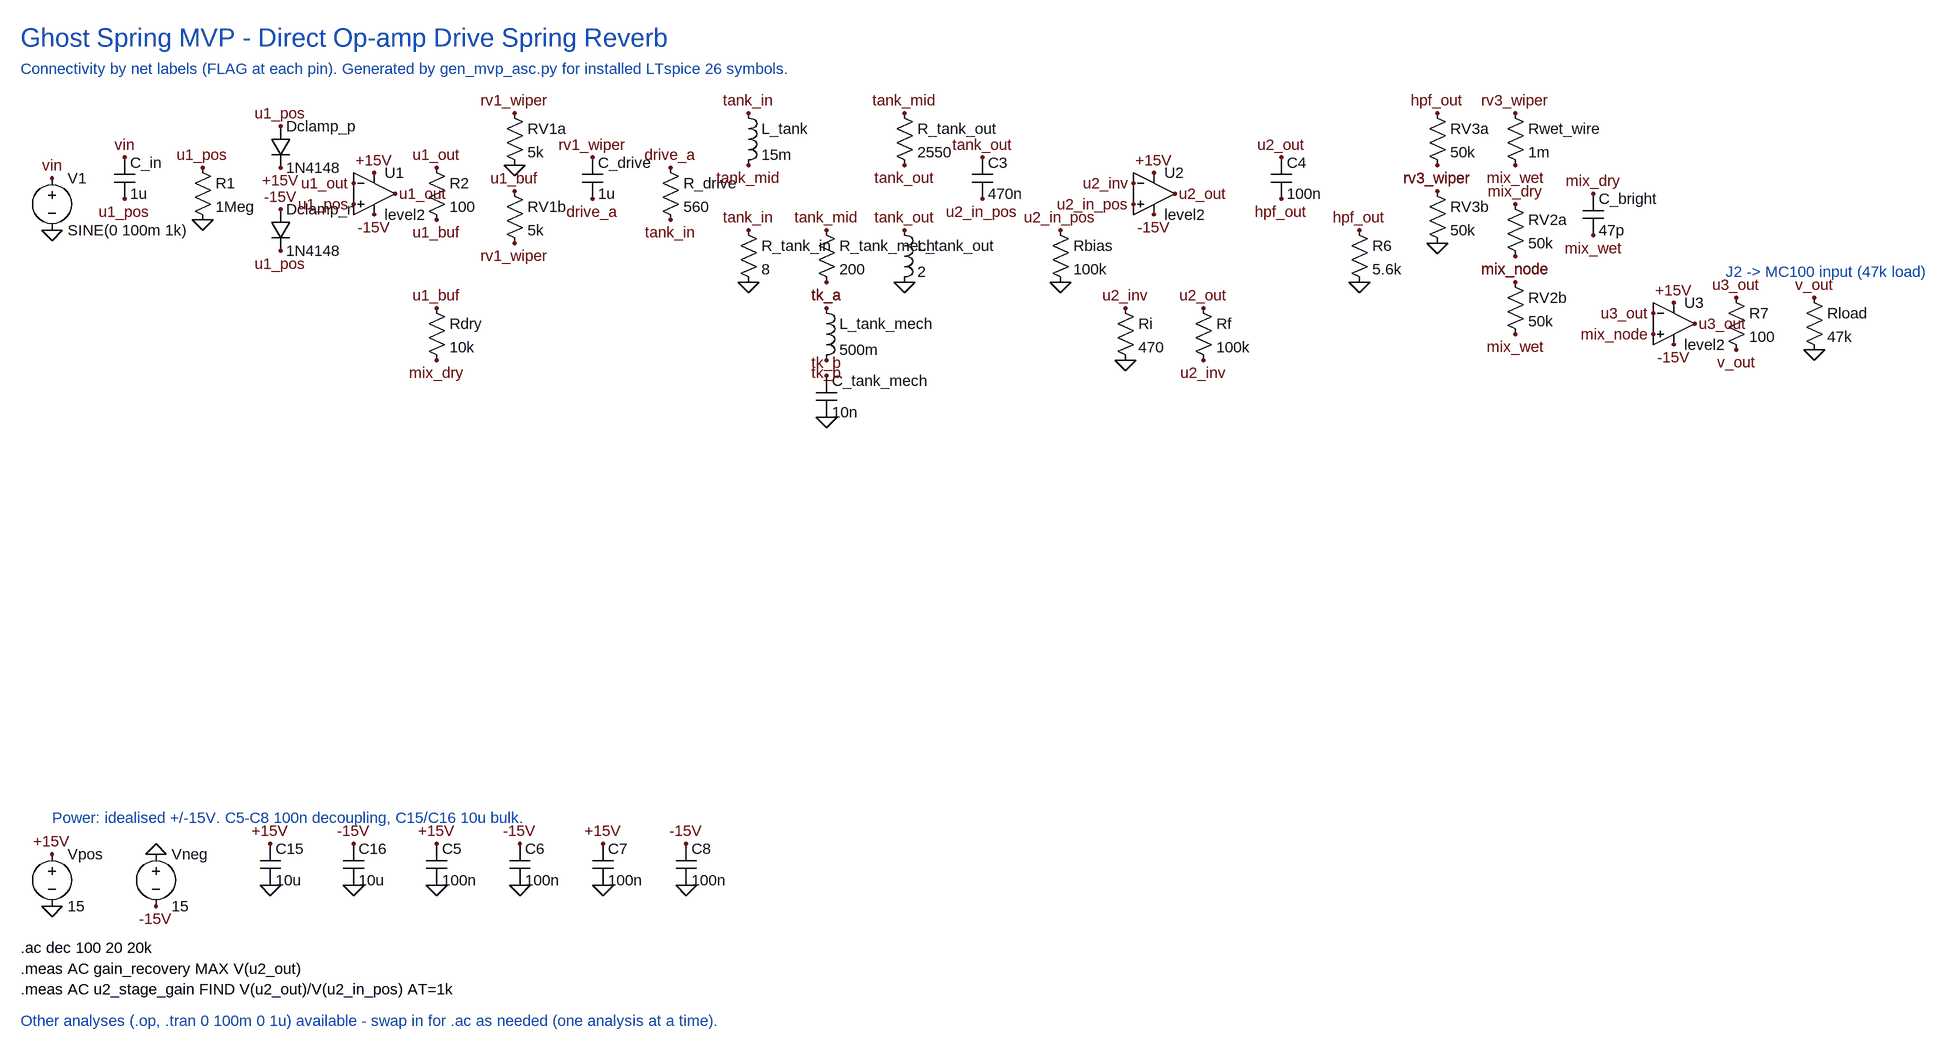
[diagram p0: schematic mvp_reverb.asc]
mvp_reverb.asc, the LTspice schematic file:
Version 4
SHEET 1 2400 1600
TEXT 16 -40 Left 4 Ghost Spring MVP - Direct Op-amp Drive Spring Reverb
TEXT 16 8 Left 2 Connectivity by net labels (FLAG at each pin). Generated by gen_mvp_asc.py for installed LTspice 26 symbols.
SYMBOL voltage 64 1200 R0
SYMATTR InstName Vpos
SYMATTR Value 15
FLAG 64 1216 +15V
FLAG 64 1296 0
SYMBOL voltage 224 1200 R0
SYMATTR InstName Vneg
SYMATTR Value 15
FLAG 224 1216 0
FLAG 224 1296 -15V
SYMBOL cap 384 1200 R0
SYMATTR InstName C15
SYMATTR Value 10u
FLAG 400 1200 +15V
FLAG 400 1264 0
SYMBOL cap 512 1200 R0
SYMATTR InstName C16
SYMATTR Value 10u
FLAG 528 1200 -15V
FLAG 528 1264 0
SYMBOL cap 640 1200 R0
SYMATTR InstName C5
SYMATTR Value 100n
FLAG 656 1200 +15V
FLAG 656 1264 0
SYMBOL cap 768 1200 R0
SYMATTR InstName C6
SYMATTR Value 100n
FLAG 784 1200 -15V
FLAG 784 1264 0
SYMBOL cap 896 1200 R0
SYMATTR InstName C7
SYMATTR Value 100n
FLAG 912 1200 +15V
FLAG 912 1264 0
SYMBOL cap 1024 1200 R0
SYMATTR InstName C8
SYMATTR Value 100n
FLAG 1040 1200 -15V
FLAG 1040 1264 0
TEXT 64 1160 Left 2 Power: idealised +/-15V. C5-C8 100n decoupling, C15/C16 10u bulk.
SYMBOL voltage 64 160 R0
SYMATTR InstName V1
SYMATTR Value SINE(0 100m 1k)
SYMATTR Value2 AC 1
FLAG 64 176 vin
FLAG 64 256 0
SYMBOL cap 160 144 R0
SYMATTR InstName C_in
SYMATTR Value 1u
FLAG 176 144 vin
FLAG 176 208 u1_pos
SYMBOL res 280 144 R0
SYMATTR InstName R1
SYMATTR Value 1Meg
FLAG 296 160 u1_pos
FLAG 296 240 0
SYMBOL diode 400 96 R0
SYMATTR InstName Dclamp_p
SYMATTR Value 1N4148
FLAG 416 96 u1_pos
FLAG 416 160 +15V
SYMBOL diode 400 224 R0
SYMATTR InstName Dclamp_n
SYMATTR Value 1N4148
FLAG 416 224 -15V
FLAG 416 288 u1_pos
SYMBOL UniversalOpamp2 560 200 R0
SYMATTR InstName U1
SYMATTR Value level2
SYMATTR Value2 Avol=1Meg GBW=8Meg Slew=20Meg Ilimit=25m Rail=0 Rinc=1T
FLAG 528 216 u1_pos
FLAG 528 184 u1_out
FLAG 560 168 +15V
FLAG 560 232 -15V
FLAG 592 200 u1_out
SYMBOL res 640 144 R0
SYMATTR InstName R2
SYMATTR Value 100
FLAG 656 160 u1_out
FLAG 656 240 u1_buf
SYMBOL res 760 60 R0
SYMATTR InstName RV1a
SYMATTR Value 5k
FLAG 776 76 rv1_wiper
FLAG 776 156 0
SYMBOL res 760 180 R0
SYMATTR InstName RV1b
SYMATTR Value 5k
FLAG 776 196 u1_buf
FLAG 776 276 rv1_wiper
SYMBOL cap 880 144 R0
SYMATTR InstName C_drive
SYMATTR Value 1u
FLAG 896 144 rv1_wiper
FLAG 896 208 drive_a
SYMBOL res 1000 144 R0
SYMATTR InstName R_drive
SYMATTR Value 560
FLAG 1016 160 drive_a
FLAG 1016 240 tank_in
SYMBOL res 1120 240 R0
SYMATTR InstName R_tank_in
SYMATTR Value 8
FLAG 1136 256 tank_in
FLAG 1136 336 0
SYMBOL ind 1120 60 R0
SYMATTR InstName L_tank
SYMATTR Value 15m
SYMATTR SpiceLine Rser=0
FLAG 1136 76 tank_in
FLAG 1136 156 tank_mid
SYMBOL res 1240 240 R0
SYMATTR InstName R_tank_mech
SYMATTR Value 200
FLAG 1256 256 tank_mid
FLAG 1256 336 tk_a
SYMBOL ind 1240 360 R0
SYMATTR InstName L_tank_mech
SYMATTR Value 500m
SYMATTR SpiceLine Rser=0
FLAG 1256 376 tk_a
FLAG 1256 456 tk_b
SYMBOL cap 1240 480 R0
SYMATTR InstName C_tank_mech
SYMATTR Value 10n
FLAG 1256 480 tk_b
FLAG 1256 544 0
SYMBOL res 1360 60 R0
SYMATTR InstName R_tank_out
SYMATTR Value 2550
FLAG 1376 76 tank_mid
FLAG 1376 156 tank_out
SYMBOL ind 1360 240 R0
SYMATTR InstName L_tank_out
SYMATTR Value 2
SYMATTR SpiceLine Rser=0
FLAG 1376 256 tank_out
FLAG 1376 336 0
SYMBOL cap 1480 144 R0
SYMATTR InstName C3
SYMATTR Value 470n
FLAG 1496 144 tank_out
FLAG 1496 208 u2_in_pos
SYMBOL res 1600 240 R0
SYMATTR InstName Rbias
SYMATTR Value 100k
FLAG 1616 256 u2_in_pos
FLAG 1616 336 0
SYMBOL UniversalOpamp2 1760 200 R0
SYMATTR InstName U2
SYMATTR Value level2
SYMATTR Value2 Avol=1Meg GBW=8Meg Slew=20Meg Ilimit=25m Rail=0 Rinc=1T
FLAG 1728 216 u2_in_pos
FLAG 1728 184 u2_inv
FLAG 1760 168 +15V
FLAG 1760 232 -15V
FLAG 1792 200 u2_out
SYMBOL res 1700 360 R0
SYMATTR InstName Ri
SYMATTR Value 470
FLAG 1716 376 u2_inv
FLAG 1716 456 0
SYMBOL res 1820 360 R0
SYMATTR InstName Rf
SYMATTR Value 100k
FLAG 1836 376 u2_out
FLAG 1836 456 u2_inv
SYMBOL cap 1940 144 R0
SYMATTR InstName C4
SYMATTR Value 100n
FLAG 1956 144 u2_out
FLAG 1956 208 hpf_out
SYMBOL res 2060 240 R0
SYMATTR InstName R6
SYMATTR Value 5.6k
FLAG 2076 256 hpf_out
FLAG 2076 336 0
SYMBOL res 2180 60 R0
SYMATTR InstName RV3a
SYMATTR Value 50k
FLAG 2196 76 hpf_out
FLAG 2196 156 rv3_wiper
SYMBOL res 2180 180 R0
SYMATTR InstName RV3b
SYMATTR Value 50k
FLAG 2196 196 rv3_wiper
FLAG 2196 276 0
SYMBOL res 640 360 R0
SYMATTR InstName Rdry
SYMATTR Value 10k
FLAG 656 376 u1_buf
FLAG 656 456 mix_dry
SYMBOL res 2300 200 R0
SYMATTR InstName RV2a
SYMATTR Value 50k
FLAG 2316 216 mix_dry
FLAG 2316 296 mix_node
SYMBOL res 2300 320 R0
SYMATTR InstName RV2b
SYMATTR Value 50k
FLAG 2316 336 mix_node
FLAG 2316 416 mix_wet
SYMBOL cap 2420 200 R0
SYMATTR InstName C_bright
SYMATTR Value 47p
FLAG 2436 200 mix_dry
FLAG 2436 264 mix_wet
SYMBOL res 2300 60 R0
SYMATTR InstName Rwet_wire
SYMATTR Value 1m
FLAG 2316 76 rv3_wiper
FLAG 2316 156 mix_wet
SYMBOL UniversalOpamp2 2560 400 R0
SYMATTR InstName U3
SYMATTR Value level2
SYMATTR Value2 Avol=1Meg GBW=8Meg Slew=20Meg Ilimit=25m Rail=0 Rinc=1T
FLAG 2528 416 mix_node
FLAG 2528 384 u3_out
FLAG 2560 368 +15V
FLAG 2560 432 -15V
FLAG 2592 400 u3_out
SYMBOL res 2640 344 R0
SYMATTR InstName R7
SYMATTR Value 100
FLAG 2656 360 u3_out
FLAG 2656 440 v_out
SYMBOL res 2760 344 R0
SYMATTR InstName Rload
SYMATTR Value 47k
FLAG 2776 360 v_out
FLAG 2776 440 0
TEXT 2640 320 Left 2 J2 -> MC100 input (47k load)
TEXT 16 1360 Left 2 !.ac dec 100 20 20k
TEXT 16 1392 Left 2 !.meas AC gain_recovery MAX V(u2_out)
TEXT 16 1424 Left 2 !.meas AC u2_stage_gain FIND V(u2_out)/V(u2_in_pos) AT=1k
TEXT 16 1472 Left 2 Other analyses (.op, .tran 0 100m 0 1u) available - swap in for .ac as needed (one analysis at a time).

The netlist it stands for:
* mvp_reverb.asc
Vpos +15V 0 15
Vneg 0 -15V 15
C15 +15V 0 10u
C16 -15V 0 10u
C5 +15V 0 100n
C6 -15V 0 100n
C7 +15V 0 100n
C8 -15V 0 100n
V1 vin 0 SINE(0 100m 1k) AC 1
C_in vin u1_pos 1u
R1 u1_pos 0 1Meg
Dclamp_p u1_pos +15V 1N4148
Dclamp_n -15V u1_pos 1N4148
XU1 u1_pos u1_out +15V -15V u1_out level.2 level2 Avol=1Meg GBW=8Meg Slew=20Meg Ilimit=25m Rail=0 Rinc=1T ilimit=25m rail=0 Vos=0 phimargin=45 en=0 enk=0 in=0 ink=0 Rin=500Meg  ; pins IN+ IN- V+ V- OUT
R2 u1_out u1_buf 100
RV1a rv1_wiper 0 5k
RV1b u1_buf rv1_wiper 5k
C_drive rv1_wiper drive_a 1u
R_drive drive_a tank_in 560
R_tank_in tank_in 0 8
L_tank tank_in tank_mid 15m Rser=0
R_tank_mech tank_mid tk_a 200
L_tank_mech tk_a tk_b 500m Rser=0
C_tank_mech tk_b 0 10n
R_tank_out tank_mid tank_out 2550
L_tank_out tank_out 0 2 Rser=0
C3 tank_out u2_in_pos 470n
Rbias u2_in_pos 0 100k
XU2 u2_in_pos u2_inv +15V -15V u2_out level.2 level2 Avol=1Meg GBW=8Meg Slew=20Meg Ilimit=25m Rail=0 Rinc=1T ilimit=25m rail=0 Vos=0 phimargin=45 en=0 enk=0 in=0 ink=0 Rin=500Meg  ; pins IN+ IN- V+ V- OUT
Ri u2_inv 0 470
Rf u2_out u2_inv 100k
C4 u2_out hpf_out 100n
R6 hpf_out 0 5.6k
RV3a hpf_out rv3_wiper 50k
RV3b rv3_wiper 0 50k
Rdry u1_buf mix_dry 10k
RV2a mix_dry mix_node 50k
RV2b mix_node mix_wet 50k
C_bright mix_dry mix_wet 47p
Rwet_wire rv3_wiper mix_wet 1m
XU3 mix_node u3_out +15V -15V u3_out level.2 level2 Avol=1Meg GBW=8Meg Slew=20Meg Ilimit=25m Rail=0 Rinc=1T ilimit=25m rail=0 Vos=0 phimargin=45 en=0 enk=0 in=0 ink=0 Rin=500Meg  ; pins IN+ IN- V+ V- OUT
R7 u3_out v_out 100
Rload v_out 0 47k
.model D D
.lib standard.dio
* Ghost Spring MVP - Direct Op-amp Drive Spring Reverb
* Connectivity by net labels (FLAG at each pin). Generated by gen_mvp_asc.py for installed LTspice 26 symbols.
* Power: idealised +/-15V. C5-C8 100n decoupling, C15/C16 10u bulk.
* J2 -> MC100 input (47k load)
.ac dec 100 20 20k
.meas AC gain_recovery MAX V(u2_out)
.meas AC u2_stage_gain FIND V(u2_out)/V(u2_in_pos) AT=1k
* Other analyses (.op, .tran 0 100m 0 1u) available - swap in for .ac as needed (one analysis at a time).
.lib UniversalOpamps2.sub
.backanno
.end